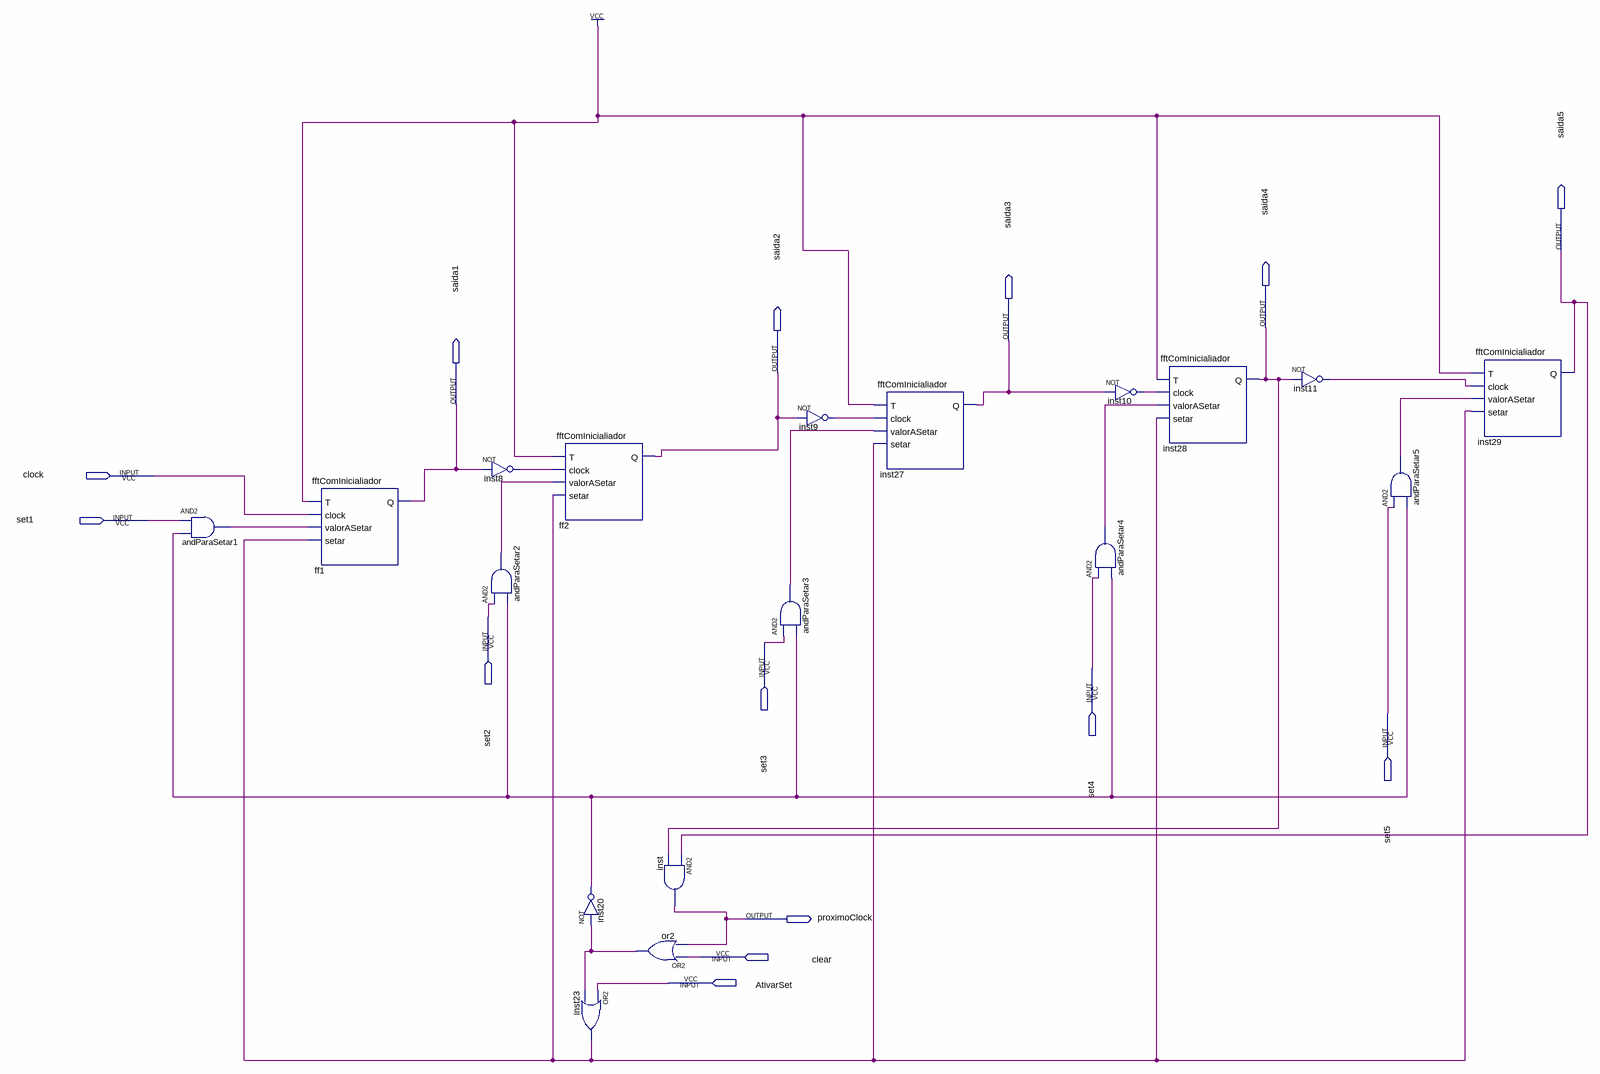
[diagram p0: schematic sheet]
// Quartus schematic ContadorDe0A24ComInicializador.bdf as structural Verilog: 18 symbols, 14 pins
module ContadorDe0A24ComInicializador (
  input  clock,
  input  set1,
  input  set2,
  input  set3,
  input  set4,
  input  set5,
  input  clear,
  input  AtivarSet,
  output saida5,
  output saida4,
  output saida3,
  output saida2,
  output saida1,
  output proximoClock
);

  wire andParaSetar1_out, andParaSetar2_out, andParaSetar3_out, andParaSetar4_out, andParaSetar5_out,
       inst8_out, inst9_out, inst10_out, inst11_out, inst20_out, inst23_out, or2_out;

  and andParaSetar1 (andParaSetar1_out, set1, inst20_out);
  fftComInicialiador ff1 (.T(1'b1), .clock(clock), .valorASetar(andParaSetar1_out), .setar(inst23_out), .Q(saida1));
  not inst8 (inst8_out, saida1);
  and andParaSetar2 (andParaSetar2_out, set2, inst20_out);
  fftComInicialiador ff2 (.T(1'b1), .clock(inst8_out), .valorASetar(andParaSetar2_out), .setar(inst23_out), .Q(saida2));
  not inst20 (inst20_out, or2_out);
  or inst23 (inst23_out, AtivarSet, or2_out);
  and inst (proximoClock, saida5, saida4);
  or or2 (or2_out, clear, proximoClock);
  and andParaSetar3 (andParaSetar3_out, set3, inst20_out);
  not inst9 (inst9_out, saida2);
  fftComInicialiador inst27 (
    .T(1'b1), .clock(inst9_out), .valorASetar(andParaSetar3_out), .setar(inst23_out), .Q(saida3));
  and andParaSetar4 (andParaSetar4_out, set4, inst20_out);
  not inst10 (inst10_out, saida3);
  fftComInicialiador inst28 (
    .T(1'b1), .clock(inst10_out), .valorASetar(andParaSetar4_out), .setar(inst23_out), .Q(saida4));
  not inst11 (inst11_out, saida4);
  and andParaSetar5 (andParaSetar5_out, set5, inst20_out);
  fftComInicialiador inst29 (
    .T(1'b1), .clock(inst11_out), .valorASetar(andParaSetar5_out), .setar(inst23_out), .Q(saida5));
endmodule
